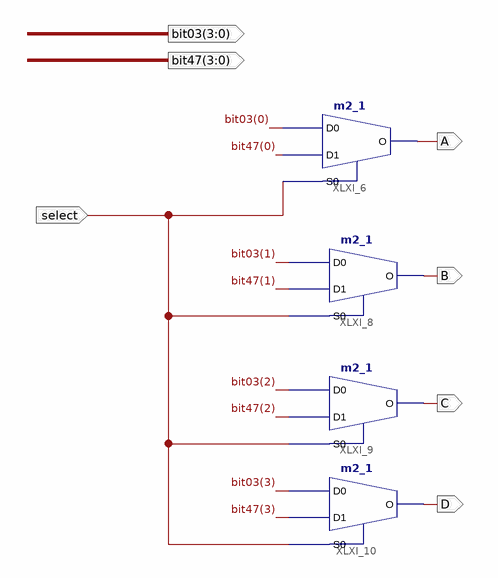
[diagram p0: schematic sheet 1]
// Xilinx ISE schematic multiplexer.sch (spartan6) as structural Verilog: 4 symbols, 7 ports
module multiplexer (
  input  select,
  output [3:0] bit03,
  output [3:0] bit47,
  output A,
  output B,
  output C,
  output D
);

  m2_1 XLXI_6 (.D0(bit03[0]), .D1(bit47[0]), .S0(select), .O(A));
  m2_1 XLXI_8 (.D0(bit03[1]), .D1(bit47[1]), .S0(select), .O(B));
  m2_1 XLXI_9 (.D0(bit03[2]), .D1(bit47[2]), .S0(select), .O(C));
  m2_1 XLXI_10 (.D0(bit03[3]), .D1(bit47[3]), .S0(select), .O(D));
endmodule
